# EAGLE schematic arduino gambar teknik (EAGLE 9.6.2)
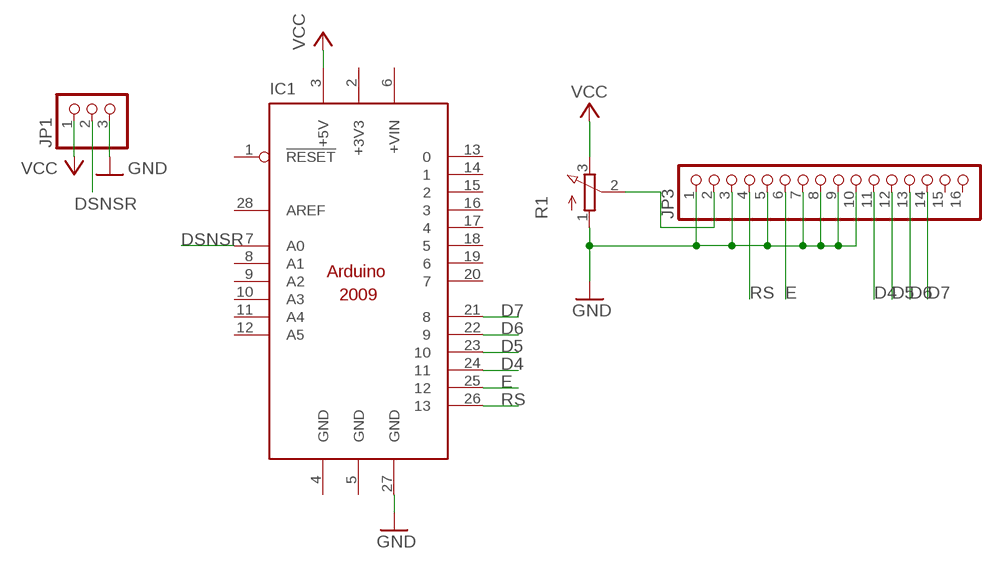
[diagram p0: schematic, sheet 1]

## Parts
IC1  ARDUINO2009_12  [ARDUINO2009_2]
JP1  PINHD-1X3  [1X03]
JP3  PINHD-1X16  [1X16]
R1  3RP/1610N  [3RP/1610N]

## Nets
D4: IC1.24 JP3.11
D5: IC1.23 JP3.12
D6: IC1.22 JP3.13
D7: IC1.21 JP3.14
DSNSR: IC1.7(A0) JP1.2
E: IC1.25 JP3.6
GND: IC1.27(GND) JP1.3 JP3.1 JP3.3 JP3.5 JP3.7 JP3.8 JP3.9 JP3.10 R1.1(A)
N$1: JP3.2 R1.2(S)
RS: IC1.26 JP3.4
VCC: IC1.3(+5V) JP1.1 R1.3(E)
Unconnected: IC1.1(!RESET) IC1.6(+VIN) IC1.8(A1) IC1.9(A2) IC1.10(A3) IC1.11(A4) IC1.12(A5) IC1.13 IC1.14 IC1.15 IC1.16 IC1.17 IC1.18 IC1.19 IC1.20 IC1.28(AREF) JP3.15 JP3.16

## Power pins joined to a net without a drawn wire
+3V3: IC1.2(+3V3)
GND: IC1.4(GND) IC1.5(GND)

## Library data of the parts
IC1 = arduino:ARDUINO2009_1: The Arduino Duemilanove ("2009") is a microcontroller board based on the ATmega168 or ATmega328. - 14 digital input/output pins (of which 6 can be used as PWM outputs) - 6 analog inputs, a 16 MHz crystal oscillator - USB connection - power jack - ISP header - reset button It contains everything needed to support the microcontroller; simply connect it to a computer with a USB cable or power it with a AC-to-DC adapter or battery to get started http://arduino.cc/en/Main/ArduinoBoardDuemilanove
JP1 = pinhead:PINHD-1X3: PIN HEADER
JP3 = pinhead:PINHD-1X16: PIN HEADER
R1 = pot:3RP/1610N: 16mm Potentiometer one level Source: http://www.alphapotentiometers.net/html/16mm_pot_2.html